# EAGLE design beerSch00 (EAGLE 9.3.0)
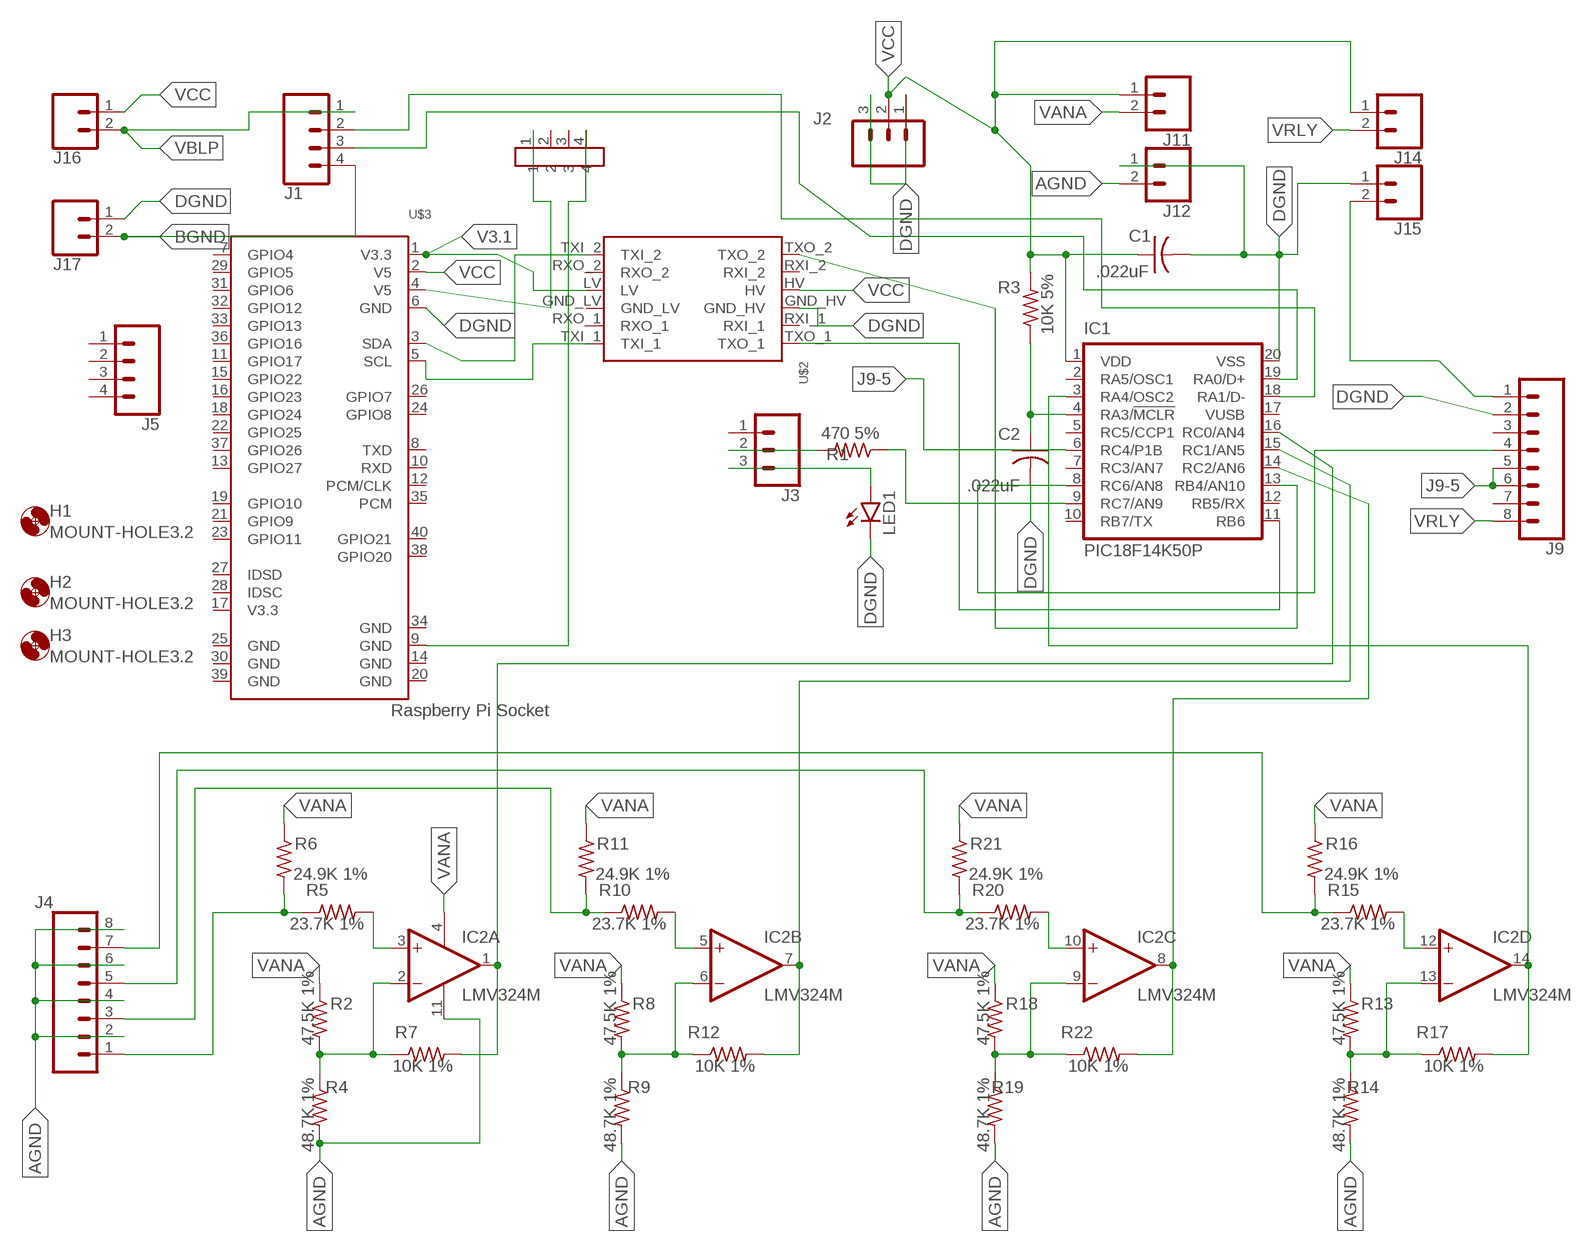
[diagram p0: schematic, sheet 1]

## Parts
C1  .022uF  C-USC0805  [C0805]
C2  .022uF  C-USC0805  [C0805]
H1  MOUNT-HOLE3.2  [3,2]
H2  MOUNT-HOLE3.2  [3,2]
H3  MOUNT-HOLE3.2  [3,2]
IC1  PIC18F14K50P  [DIL20]
IC2  LMV324M  [SO14]
J1  CONN_04  [1X04]
J2  CONN_03  [1X03]
J3  CONN_03  [1X03]
J4  CONN_08"  [1X08]
J5  CONN_04  [1X04]
J9  CONN_08"  [1X08]
J11  CONN_02  [1X02]
J12  CONN_02  [1X02]
J14  CONN_02  [1X02]
J15  CONN_02  [1X02]
J16  CONN_02  [1X02]
J17  CONN_02  [1X02]
LED1  LEDSML0805  [SML0805]
R1  470 5%  R-US_R0603  [R0603]
R2  47.5K 1%  R-US_R0603  [R0603]
R3  10K 5%  R-US_R0603  [R0603]
R4  48.7K 1%  R-US_R0603  [R0603]
R5  23.7K 1%  R-US_R0603  [R0603]
R6  24.9K 1%  R-US_R0603  [R0603]
R7  10K 1%  R-US_R0603  [R0603]
R8  47.5K 1%  R-US_R0603  [R0603]
R9  48.7K 1%  R-US_R0603  [R0603]
R10  23.7K 1%  R-US_R0603  [R0603]
R11  24.9K 1%  R-US_R0603  [R0603]
R12  10K 1%  R-US_R0603  [R0603]
R13  47.5K 1%  R-US_R0603  [R0603]
R14  48.7K 1%  R-US_R0603  [R0603]
R15  23.7K 1%  R-US_R0603  [R0603]
R16  24.9K 1%  R-US_R0603  [R0603]
R17  10K 1%  R-US_R0603  [R0603]
R18  47.5K 1%  R-US_R0603  [R0603]
R19  48.7K 1%  R-US_R0603  [R0603]
R20  23.7K 1%  R-US_R0603  [R0603]
R21  24.9K 1%  R-US_R0603  [R0603]
R22  10K 1%  R-US_R0603  [R0603]
U$1  CONN_4  [PINS_90]
U$2  LEVELCONV  [PLUG_THROUGHHOLE]
U$3  RASPBERRYPI_SOCKET_UNDER  [RASPBERRYPI_UNDERBD]

## Nets
AGND: IC2.11(P:V-) J4.2 J4.4 J4.6 J4.8 J12.2 R4.2 R9.2 R14.2 R19.2
BGND: J1.4 J17.2
DGND: C1.2 C2.2 IC1.20(VSS) J2.1 J2.3 J9.2 J12.1 J15.1 J17.1 LED1.C U$2.GND_HV U$3.6(GND)
J9-5: IC1.6(RC4/P1B) J9.5 J9.6
N$1: U$2.TXI_2 U$3.3(SDA)
N$2: U$2.TXI_1 U$3.5(SCL)
N$3: IC1.13(RB4/AN10) U$2.TXO_2
N$4: IC1.11(RB6) U$2.TXO_1
N$5: C2.1 IC1.4(RA3/!MCLR!) R3.1
N$6: J3.2 R1.2
N$7: IC1.9(RC7/AN9) R1.1
N$8: J3.3 LED1.A
N$9: IC2.2(A:-IN) R2.2 R4.1 R7.1
N$10: J4.1 R5.1 R6.2
N$11: IC2.3(A:+IN) R5.2
N$12: IC1.16(RC0/AN4) IC2.1(A:OUT) R7.2
N$13: IC2.6(B:-IN) R8.2 R9.1 R12.1
N$14: J4.3 R10.1 R11.2
N$15: IC2.5(B:+IN) R10.2
N$16: J9.1 J15.2
N$17: U$1.4 U$3.9(GND)
N$18: IC2.13(D:-IN) R13.2 R14.1 R17.1
N$19: J4.7 R15.1 R16.2
N$20: IC2.12(D:+IN) R15.2
N$21: IC1.8(RC6/AN8) J9.4
N$22: IC2.9(C:-IN) R18.2 R19.1 R22.1
N$23: J4.5 R20.1 R21.2
N$24: IC2.10(C:+IN) R20.2
N$25: U$1.1 U$3.4(V5)
N$26: IC1.19(RA0/D+) J1.3
N$28: IC1.3(RA4/OSC2) IC2.14(D:OUT) R17.2
N$29: IC1.14(RC2/AN6) IC2.8(C:OUT) R22.2
N$30: IC1.15(RC1/AN5) IC2.7(B:OUT) R12.2
N$31: IC1.18(RA1/D-) J1.2
V3.1: U$2.LV U$3.1(V3.3)
VANA: IC2.4(P:V+) J11.2 R2.1 R6.1 R8.1 R11.1 R13.1 R16.1 R18.1 R21.1
VBLP: J1.1 J16.2
VCC: C1.1 IC1.1(VDD) J2.2 J11.1 J14.1 J16.1 R3.2 U$2.HV U$3.2(V5)
VRLY: J9.8 J14.2
Unconnected: IC1.2(RA5/OSC1) IC1.5(RC5/CCP1) IC1.7(RC3/AN7) IC1.10(RB7/TX) IC1.12(RB5/RX) IC1.17(VUSB) J3.1 J5.1 J5.2 J5.3 J5.4 J9.3 J9.7 U$1.2 U$1.3 U$2.GND_LV U$2.RXI_1 U$2.RXI_2 U$2.RXO_1 U$2.RXO_2 U$3.7(GPIO4) U$3.8(TXD) U$3.10(RXD) U$3.11(GPIO17) U$3.12(PCM/CLK) U$3.13(GPIO27) U$3.14(GND) U$3.15(GPIO22) U$3.16(GPIO23) U$3.17(V3.3) U$3.18(GPIO24) U$3.19(GPIO10) U$3.20(GND) U$3.21(GPIO9) U$3.22(GPIO25) U$3.23(GPIO11) U$3.24(GPIO8) U$3.25(GND) U$3.26(GPIO7) U$3.27(IDSD) U$3.28(IDSC) U$3.29(GPIO5) U$3.30(GND) U$3.31(GPIO6) U$3.32(GPIO12) U$3.33(GPIO13) U$3.34(GND) U$3.35(PCM) U$3.36(GPIO16) U$3.37(GPIO26) U$3.38(GPIO20) U$3.39(GND) U$3.40(GPIO21)

## Library data of the parts
C1 C2 = resistor:C-US: CAPACITOR, American symbol
H1-H3 = holes:MOUNT-HOLE: MOUNTING HOLE with drill center marker
IC1 = pic18f14k50:PIC18F14K50
IC2 = linear:LMV324?*: Quad General Purpose, Low Voltage, Rail-to-Rail Output Operational Amplifiers Source: http://www.national.com/mpf/LM/LMV321.html http://www.national.com/dt/lmv_qual.pdf
J1 J5 = SparkFun-Connectors:CONN_04: Multi connection point. Often used as Generic Header-pin footprint for 0.1 inch spaced/style header connections On any of the 0.1 inch spaced packages, you can populate with these: Break Away Headers - Straight <https://www.sparkfun.com/products/116> (PRT-00116) Break Away Male Headers - Right Angle <https://www.sparkfun.com/products/553> (PRT-00553) Female Headers <https://www.sparkfun.com/products/115> (PRT-00115) Break Away Headers - Machine Pin <https://www.sparkfun.com/products/117> (PRT-00117) Break Away Female Headers - Swiss Machine Pin <https://www.sparkfun.com/products/743> (PRT-00743) For SCREWTERMINALS and SPRING TERMINALS visit here: Screw Terimnals on SparkFun.com <https://www.sparkfun.com/search/results?term=Screw+Terminals> (5mm/3.5mm/2.54mm spacing) This device is also useful as a general connection point to wire up your design to another part of your project. Our various solder wires solder well into these plated through hole pads. Hook-Up Wire - Assortment (Stranded, 22 AWG) <https://www.sparkfun.com/products/11375> (PRT-11375) Hook-Up Wire - Assortment (Solid Core, 22 AWG) <https://www.sparkfun.com/products/11367> (PRT-11367) View the entire wire category on our website here <https://www.sparkfun.com/categories/141> Special notes: Molex polarized connector foot print use with SKU : PRT-08231 with associated crimp pins and housings. 1MM SMD Version SKU: PRT-10208; PROD_ID: CONN-09696
J2 J3 = SparkFun-Connectors:CONN_03: Multi connection point. Often used as Generic Header-pin footprint for 0.1 inch spaced/style header connections On any of the 0.1 inch spaced packages, you can populate with these: Break Away Headers - Straight <https://www.sparkfun.com/products/116> (PRT-00116) Break Away Male Headers - Right Angle <https://www.sparkfun.com/products/553> (PRT-00553) Female Headers <https://www.sparkfun.com/products/115> (PRT-00115) Break Away Headers - Machine Pin <https://www.sparkfun.com/products/117> (PRT-00117) Break Away Female Headers - Swiss Machine Pin <https://www.sparkfun.com/products/743> (PRT-00743) Stackable Header - 3 Pin (Female, 0.1") <https://www.sparkfun.com/products/13875> (PRT-13875) For SCREWTERMINALS and SPRING TERMINALS visit here: Screw Terimnals on SparkFun.com <https://www.sparkfun.com/search/results?term=Screw+Terminals> (5mm/3.5mm/2.54mm spacing) This device is also useful as a general connection point to wire up your design to another part of your project. Our various solder wires solder well into these plated through hole pads. Hook-Up Wire - Assortment (Stranded, 22 AWG) <https://www.sparkfun.com/products/11375> (PRT-11375) Hook-Up Wire - Assortment (Solid Core, 22 AWG) <https://www.sparkfun.com/products/11367> (PRT-11367) View the entire wire category on our website here <https://www.sparkfun.com/categories/141> Special notes: Molex polarized connector foot print use with SKU : PRT-08232 with associated crimp pins and housings.
J4 J9 = SparkFun-Connectors:CONN_08: Multi connection point. Often used as Generic Header-pin footprint for 0.1 inch spaced/style header connections On any of the 0.1 inch spaced packages, you can populate with these: Break Away Headers - Straight <https://www.sparkfun.com/products/116> (PRT-00116) Break Away Male Headers - Right Angle <https://www.sparkfun.com/products/553> (PRT-00553) Female Headers <https://www.sparkfun.com/products/115> (PRT-00115) Break Away Headers - Machine Pin <https://www.sparkfun.com/products/117> (PRT-00117) Break Away Female Headers - Swiss Machine Pin <https://www.sparkfun.com/products/743> (PRT-00743) Arduino Stackable Header - 8 Pin <https://www.sparkfun.com/products/9279> (PRT-09279) For SCREWTERMINALS and SPRING TERMINALS visit here: Screw Terimnals on SparkFun.com <https://www.sparkfun.com/search/results?term=Screw+Terminals> (5mm/3.5mm/2.54mm spacing) This device is also useful as a general connection point to wire up your design to another part of your project. Our various solder wires solder well into these plated through hole pads. Hook-Up Wire - Assortment (Stranded, 22 AWG) <https://www.sparkfun.com/products/11375> (PRT-11375) Hook-Up Wire - Assortment (Solid Core, 22 AWG) <https://www.sparkfun.com/products/11367> (PRT-11367) View the entire wire category on our website here <https://www.sparkfun.com/categories/141> Special notes: Molex polarized connector foot print use with SKU : PRT-08231 with associated crimp pins and housings. 1MM SMD Version SKU: PRT-10208 NOTES ON THE VARIANTS LOCK and LOCK_LONGPADS... This footprint was designed to help hold the alignment of a through-hole component (i.e. 6-pin header) while soldering it into place. You may notice that each hole has been shifted either up or down by 0.005 of an inch from it's more standard position (which is a perfectly straight line). This slight alteration caused the pins (the squares in the middle) to touch the edges of the holes. Because they are alternating, it causes a "brace" to hold the component in place. 0.005 has proven to be the perfect amount of "off-center" position when using our standard breakaway headers. Although looks a little odd when you look at the bare footprint, once you have a header in there, the alteration is very hard to notice. Also,if you push a header all the way into place, it is covered up entirely on the bottom side.; PROD_ID: CONN-08438
J11 J12 J14-J17 = SparkFun-Connectors:CONN_02: Multi connection point. Often used as Generic Header-pin footprint for 0.1 inch spaced/style header connections On any of the 0.1 inch spaced packages, you can populate with these: Break Away Headers - Straight <https://www.sparkfun.com/products/116> (PRT-00116) Break Away Male Headers - Right Angle <https://www.sparkfun.com/products/553> (PRT-00553) Female Headers <https://www.sparkfun.com/products/115> (PRT-00115) Break Away Headers - Machine Pin <https://www.sparkfun.com/products/117> (PRT-00117) Break Away Female Headers - Swiss Machine Pin <https://www.sparkfun.com/products/743> (PRT-00743) For SCREWTERMINALS and SPRING TERMINALS visit here: Screw Terimnals on SparkFun.com <https://www.sparkfun.com/search/results?term=Screw+Terminals> (5mm/3.5mm/2.54mm spacing) This device is also useful as a general connection point to wire up your design to another part of your project. Our various solder wires solder well into these plated through hole pads. Hook-Up Wire - Assortment (Stranded, 22 AWG) <https://www.sparkfun.com/products/11375> (PRT-11375) Hook-Up Wire - Assortment (Solid Core, 22 AWG) <https://www.sparkfun.com/products/11367> (PRT-11367) View the entire wire category on our website here <https://www.sparkfun.com/categories/141> Special notes: Molex polarized connector foot print use with: PRT-08233 with associated crimp pins and housings. 2.54_SCREWTERM for use with PRT-10571. 3.5mm Screw Terminal footprints for PRT-08084 5mm Screw Terminal footprints for use with PRT-08432
LED1 = led:LED: LED OSRAM: - CHIPLED LG R971, LG N971, LY N971, LG Q971, LY Q971, LO R971, LY R971 LH N974, LH R974 LS Q976, LO Q976, LY Q976 LO Q996 - Hyper CHIPLED LW Q18S LB Q993, LB Q99A, LB R99A - SideLED LS A670, LO A670, LY A670, LG A670, LP A670 LB A673, LV A673, LT A673, LW A673 LH A674 LY A675 LS A676, LA A676, LO A676, LY A676, LW A676 LS A679, LY A679, LG A679 - Hyper Micro SIDELED® LS Y876, LA Y876, LO Y876, LY Y876 LT Y87S - SmartLED LW L88C, LW L88S LB L89C, LB L89S, LG L890 LS L89K, LO L89K, LY L89K LS L896, LA L896, LO L896, LY L896 - TOPLED LS T670, LO T670, LY T670, LG T670, LP T670 LSG T670, LSP T670, LSY T670, LOP T670, LYG T670 LG T671, LOG T671, LSG T671 LB T673, LV T673, LT T673, LW T673 LH T674 LS T676, LA T676, LO T676, LY T676, LB T676, LH T676, LSB T676, LW T676 LB T67C, LV T67C, LT T67C, LS T67K, LO T67K, LY T67K, LW E67C LS E67B, LA E67B, LO E67B, LY E67B, LB E67C, LV E67C, LT E67C LW T67C LS T679, LY T679, LG T679 LS T770, LO T770, LY T770, LG T770, LP T770 LB T773, LV T773, LT T773, LW T773 LH T774 LS E675, LA E675, LY E675, LS T675 LS T776, LA T776, LO T776, LY T776, LB T776 LHGB T686 LT T68C, LB T68C - Hyper Mini TOPLED® LB M676 - Mini TOPLED Santana® LG M470 LS M47K, LO M47K, LY M47K Source: http://www.osram.convergy.de LUXEON: - LUMILED® LXK2-PW12-R00, LXK2-PW12-S00, LXK2-PW14-U00, LXK2-PW14-V00 LXK2-PM12-R00, LXK2-PM12-S00, LXK2-PM14-U00 LXK2-PE12-Q00, LXK2-PE12-R00, LXK2-PE12-S00, LXK2-PE14-T00, LXK2-PE14-U00 LXK2-PB12-K00, LXK2-PB12-L00, LXK2-PB12-M00, LXK2-PB14-N00, LXK2-PB14-P00, LXK2-PB14-Q00 LXK2-PR12-L00, LXK2-PR12-M00, LXK2-PR14-Q00, LXK2-PR14-R00 LXK2-PD12-Q00, LXK2-PD12-R00, LXK2-PD12-S00 LXK2-PH12-R00, LXK2-PH12-S00 LXK2-PL12-P00, LXK2-PL12-Q00, LXK2-PL12-R00 Source: www.luxeon.com KINGBRIGHT: KA-3528ASYC Source: www.kingbright.com
R1-R22 = resistor:R-US_: RESISTOR, American symbol
U$1 = Connectors:CONN_4
U$2 = LevelConv:LEVELCONV
U$3 = RaspberryPi:RASPBERRYPI_SOCKET_UNDER

## Board
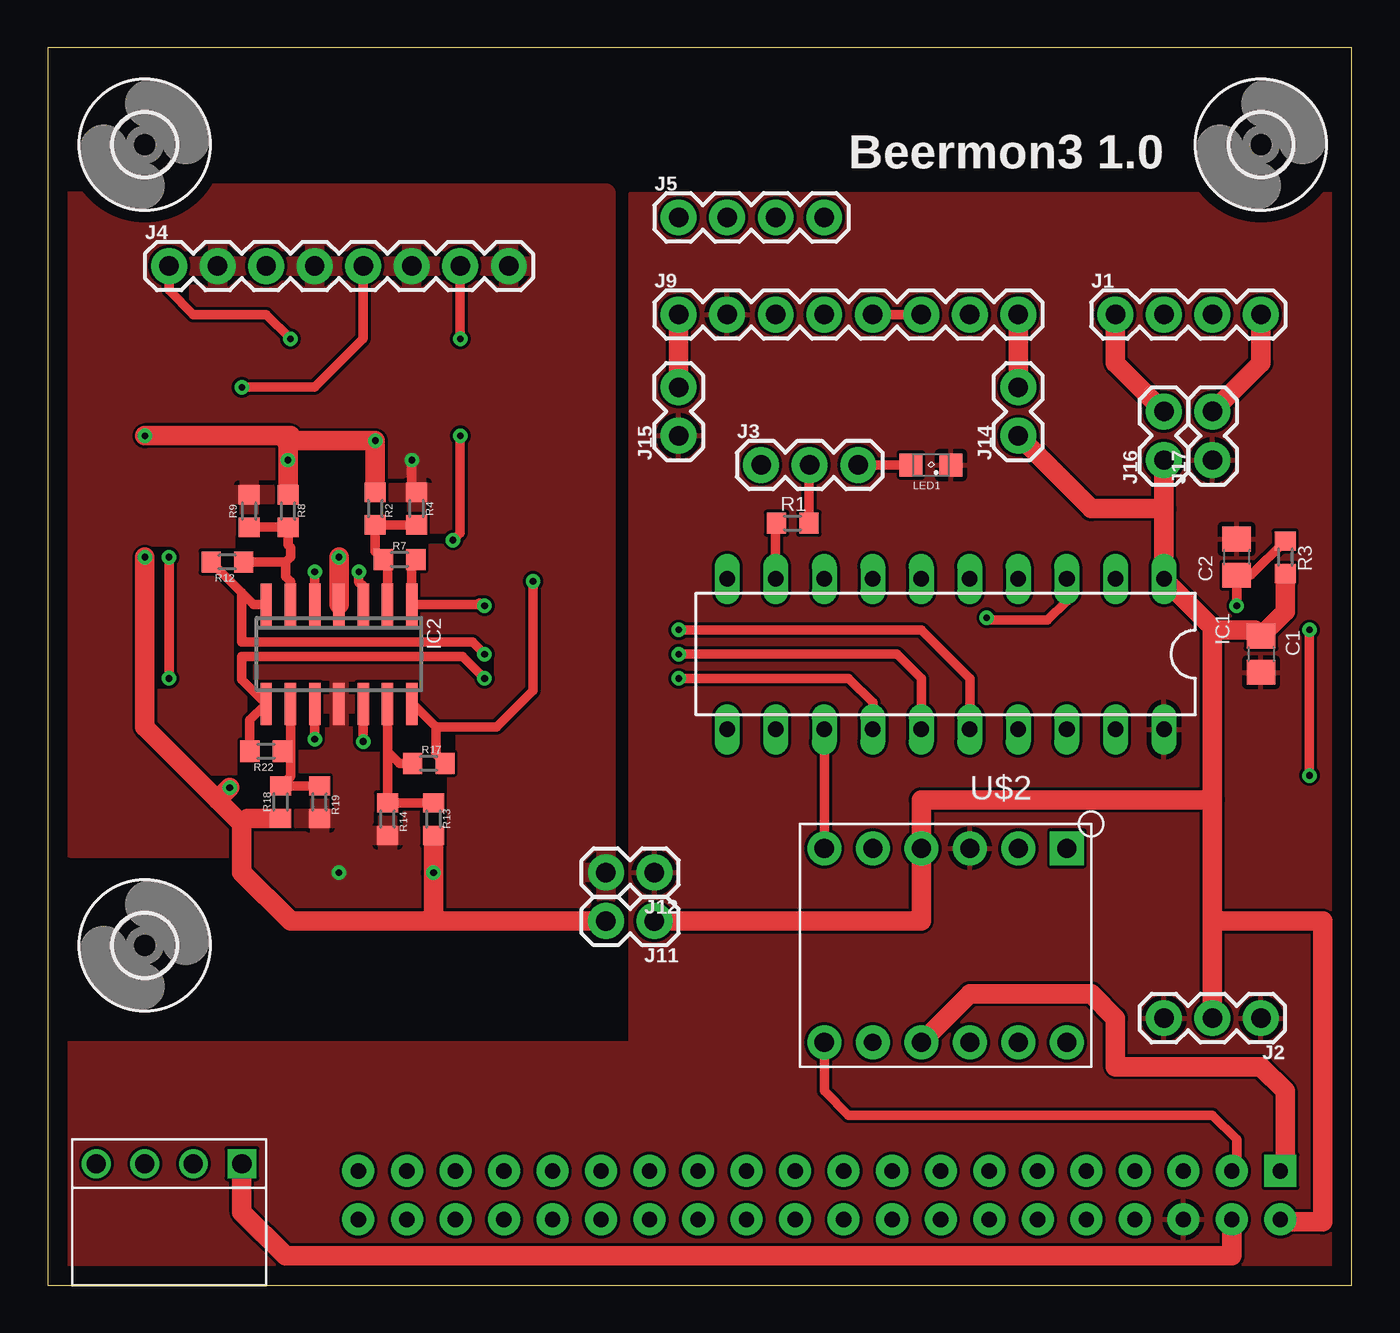
[diagram p1: board, top side]
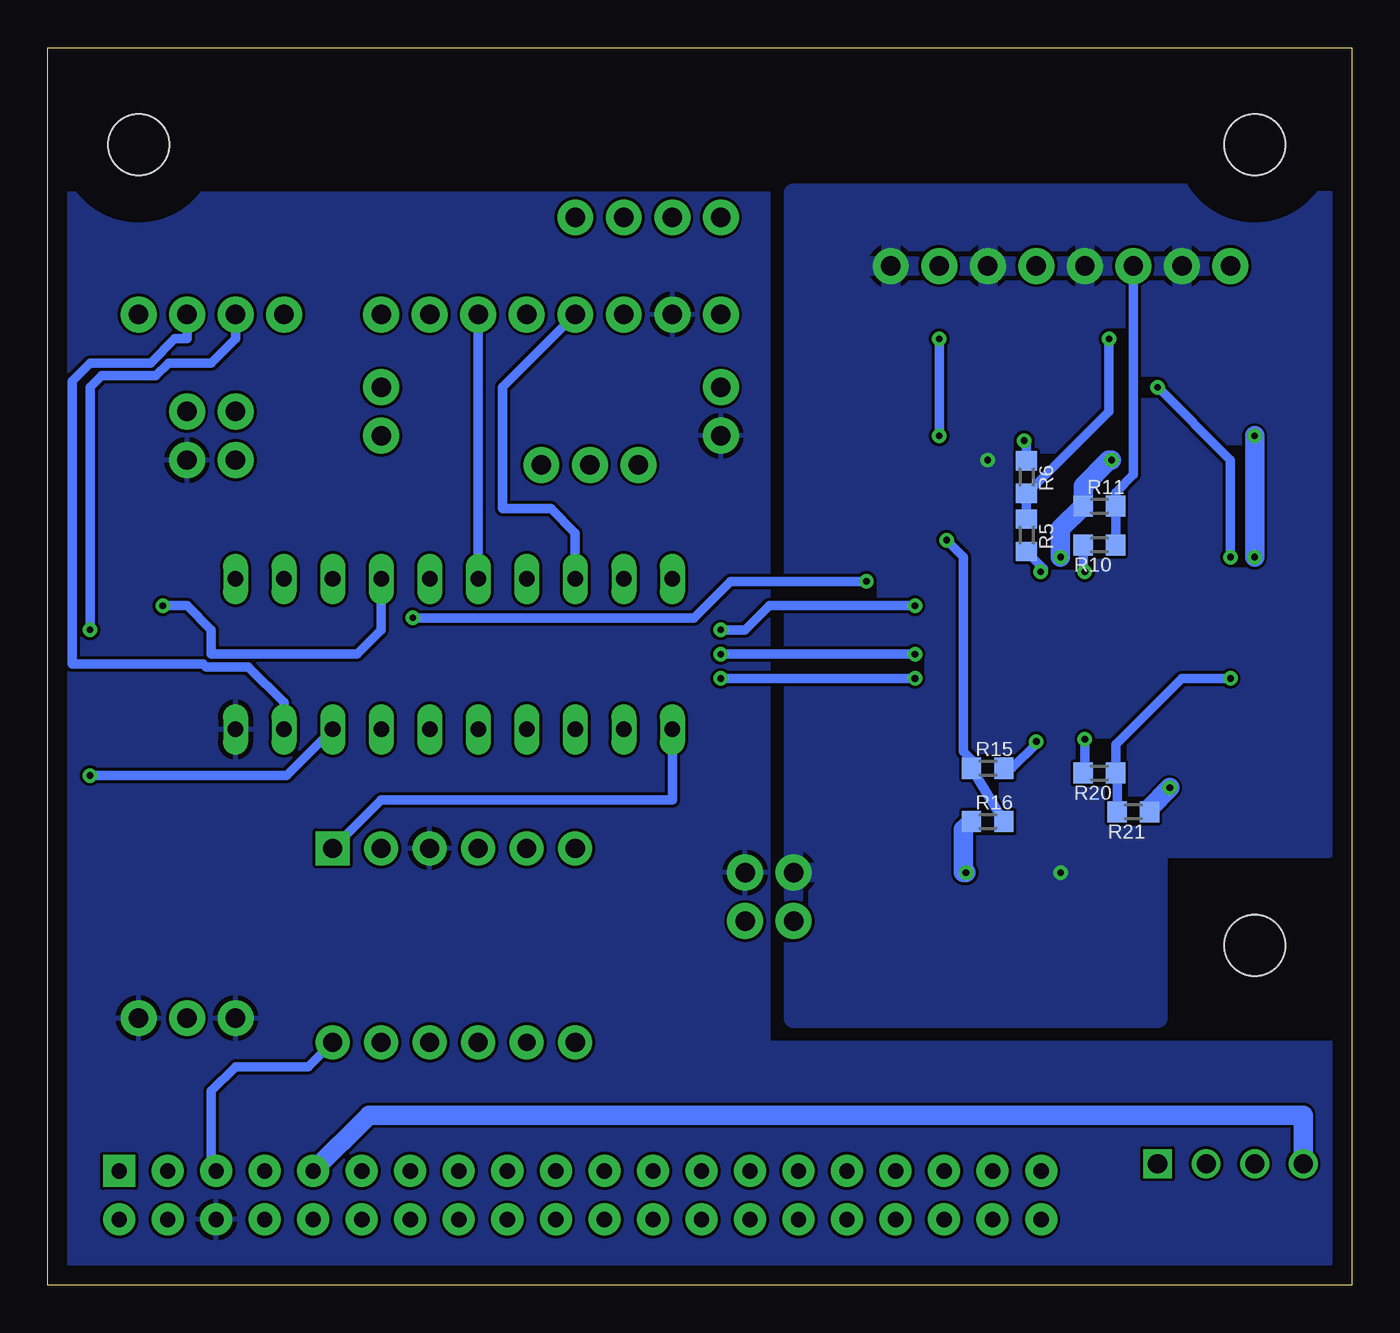
[diagram p2: board, bottom side, seen from below]

Size 68.25 x 64.76 mm. Coordinates in mm from the lower left corner, seen from the top.
Outline: 0,0 68.25,0 68.25,64.76 0,64.76 0,0
Copper layers (1*16): Top 0.035mm / dielectric 1.5mm / Bottom 0.035mm
Design rules "default *": minimum track width 6mil, minimum drill 0.35mm, track to track 6mil, track to pad 6mil, pad to pad 6mil, via to via 6mil, smd to smd 6mil, copper to edge 40mil, drill to drill 6mil, minimum pad ring 10mil, minimum via ring 8mil, stop-mask expansion 4mil, vias tented up to drill 0mil, thermal gap 10mil

### Footprints (pad centres in the part's own frame; a part is rotated, then mirrored left to right if it is on the bottom)
C0805 = smd 1.3 x 1.5: 1 -0.95,0; 2 0.95,0
3,2 = hole 3.2: 0,0
DIL20 = drill 0.813 long: 1 -11.43,-3.937; 2 -8.89,-3.937; 3 -6.35,-3.937; 4 -3.81,-3.937; 5 -1.27,-3.937; 6 1.27,-3.937; 7 3.81,-3.937; 8 6.35,-3.937; 9 8.89,-3.937; 10 11.43,-3.937; 11 11.43,3.937; 12 8.89,3.937; 13 6.35,3.937; 14 3.81,3.937; 15 1.27,3.937; 16 -1.27,3.937; 17 -3.81,3.937; 18 -6.35,3.937; 19 -8.89,3.937; 20 -11.43,3.937
SO14 = smd 0.6 x 2.2: 1 -3.81,-2.6; 2 -2.54,-2.6; 3 -1.27,-2.6; 4 0,-2.6; 5 1.27,-2.6; 6 2.54,-2.6; 7 3.81,-2.6; 8 3.81,2.6; 9 2.54,2.6; 10 1.27,2.6; 11 0,2.6; 12 -1.27,2.6; 13 -2.54,2.6; 14 -3.81,2.6
1X04 = drill 1.016 pad 1.88: 1 0,0; 2 2.54,0; 3 5.08,0; 4 7.62,0
1X03 = drill 1.016 pad 1.88: 1 0,0; 2 2.54,0; 3 5.08,0
1X08 = drill 1.016 pad 1.88: 1 0,0; 2 2.54,0; 3 5.08,0; 4 7.62,0; 5 10.16,0; 6 12.7,0; 7 15.24,0; 8 17.78,0
1X02 = drill 1.016 pad 1.88: 1 0,0; 2 2.54,0
SML0805 = smd 1.2 x 1.2: A 1.05,0; C -1.05,0
R0603 = smd 1 x 1.1: 1 -0.85,0; 2 0.85,0
PINS_90 = drill 1 square: 1 -5.08,-2.54 | drill 1: 2 -2.54,-2.54; 3 0,-2.54; 4 2.54,-2.54
PLUG_THROUGHHOLE = drill 1 pad 1.778: GND_HV 2.54,5.08; GND_LV 2.54,-5.08; HV 0,5.08; LV 0,-5.08; RXI_1 5.08,5.08; RXI_2 -2.54,5.08; RXO_1 5.08,-5.08; TXI_1 7.62,-5.08; TXI_2 -5.08,-5.08; TXO_2 -5.08,5.08 | drill 0.9 pad 1.778: RXO_2 -2.54,-5.08 | drill 1 pad 1.778 square: TXO_1 7.62,5.08
RASPBERRYPI_UNDERBD = drill 0.8 pad 1.676 square: 1 -25.4,0 | drill 0.8 pad 1.676: 2 -25.4,2.54; 3 -22.86,0; 4 -22.86,2.54; 5 -20.32,0; 6 -20.32,2.54; 7 -17.78,0; 8 -17.78,2.54; 9 -15.24,0; 10 -15.24,2.54; 11 -12.7,0; 12 -12.7,2.54; 13 -10.16,0; 14 -10.16,2.54; 15 -7.62,0; 16 -7.62,2.54; 17 -5.08,0; 18 -5.08,2.54; 19 -2.54,0; 20 -2.54,2.54; 21 0,0; 22 0,2.54; 23 2.54,0; 24 2.54,2.54; 25 5.08,0; 26 5.08,2.54; 27 7.62,0; 28 7.62,2.54; 29 10.16,0; 30 10.16,2.54; 31 12.7,0; 32 12.7,2.54; 33 15.24,0; 34 15.24,2.54; 35 17.78,0; 36 17.78,2.54; 37 20.32,0; 38 20.32,2.54; 39 22.86,0; 40 22.86,2.54

### Placement (x,y rotation side)
C1  63.5,33.02 270 top
C2  62.23,38.1 90 top
H1  63.5,59.69 0 top
H2  5.08,59.69 0 top
H3  5.08,17.78 0 top
IC1  46.99,33.02 180 top
IC2  15.24,33.02 180 top
J1  55.88,50.8 0 top
J2  63.5,13.97 180 top
J3  37.34,42.93 0 top
J4  6.35,53.34 0 top
J5  33.02,55.88 0 top
J9  33.02,50.8 0 top
J11  31.75,19.05 180 top
J12  31.75,21.59 180 top
J14  50.8,44.45 90 top
J15  33.02,44.45 90 top
J16  58.42,43.18 90 top
J17  60.96,43.18 90 top
LED1  46.23,42.93 180 top
R1  38.99,39.88 0 top
R2  17.14,40.64 270 top
R3  64.77,38.1 270 top
R4  19.3,40.64 90 top
R5  17.02,39.24 270 bottom
R6  17.02,42.29 270 bottom
R7  18.41,37.97 0 top
R8  12.57,40.51 270 top
R9  10.54,40.51 90 top
R10  13.21,38.73 180 bottom
R11  13.21,40.77 0 bottom
R12  9.4,37.85 180 top
R13  20.19,24.38 90 top
R14  17.78,24.38 270 top
R15  19.05,27.05 0 bottom
R16  19.05,24.26 0 bottom
R17  19.94,27.3 0 top
R18  12.19,25.27 90 top
R19  14.22,25.27 270 top
R20  13.21,26.8 180 bottom
R21  11.43,24.77 180 bottom
R22  11.43,27.94 180 top
U$1  5.08,3.81 180 top
U$2  45.72,17.78 0 top
U$3  39.12,5.97 180 top

### Tracks (layer width: path | path; a pad name or v marks a point on that pad's centre or on a via)
AGND  (via drill 0.35)
  Top 0.508: R4.2 19.05,41.74 v19.05,43.18
  other vias: 15.24,21.59
  pour Top: 10.16,13.97 29.21,13.97 29.21,57.15 1.27,57.15 1.27,22.86 10.16,22.86
  pour Bottom: 10.16,13.97 29.21,13.97 29.21,57.15 1.27,57.15 1.27,22.86 10.16,22.86
BGND
  Top 1.016: J17.2 63.5,48.26 J1.4
DGND
  pour Top: 0,0 0,12.7 30.48,12.7 30.48,57.15 68.58,57.15 68.58,0
  pour Bottom: 0,0 0,12.7 30.48,12.7 30.48,57.15 68.58,57.15 68.58,0
J9-5
  Top 0.508: J9.6 J9.5
  Bottom 0.508: J9.6 IC1.6
N$1
  Top 0.508: U$2.TXI_2 40.64,10.16 41.91,8.89 60.96,8.89 62.23,7.62 62.23,6.22 U$3.3
N$2
  Bottom 0.508: U$2.TXI_1 54.61,11.43 58.42,11.43 59.69,10.16 59.69,6.22 U$3.5
N$3
  Top 0.508: U$2.TXO_2 IC1.13
N$4
  Bottom 0.508: IC1.11 35.56,25.4 50.8,25.4 U$2.TXO_1
N$5  (via drill 0.35)
  Top 0.508: R3.1 62.97,37.15 C2.1 v62.23,35.56
  Bottom 0.508: v62.23,35.56 60.96,35.56 59.69,34.29 59.69,33.02 52.07,33.02 50.8,34.29 IC1.4
N$6
  Top 0.508: R1.2 39.84,42.89 J3.2
N$7
  Top 0.508: IC1.9 38.1,39.84 R1.1
N$8
  Top 0.508: J3.3 LED1.A
N$9
  Top 0.508: R4.1 R2.2 17.14,38.39 R7.1 17.78,37.76 IC2.2
N$10  (via drill 0.35)
  Top 0.508: v12.7,49.53 11.43,50.8 7.62,50.8 6.35,52.07 J4.1
  Bottom 0.508: R5.1 R6.2 16.98,41.44 12.7,45.72 v12.7,49.53
N$11  (via drill 0.35)
  Top 0.508: v16.28,37.34 16.28,36.81 16.51,36.58 IC2.3
  Bottom 0.508: R5.2 16.13,37.5 16.13,37.34 v16.28,37.34
N$12  (via drill 0.35)
  Top 0.508: IC1.16 48.26,31.75 45.72,34.29 v33.02,34.29 | R7.2 19.05,37.76 IC2.1 22.54,35.62 22.61,35.69 22.73,35.56 v22.86,35.56
  Bottom 0.508: v22.86,35.56 30.48,35.56 31.75,34.29 v33.02,34.29
N$13
  Top 0.508: R9.1 R8.2 12.57,38.73 12.7,38.61 12.7,38.1 12.45,37.85 | 12.45,37.85 R12.1 | 12.45,37.85 12.45,37.08 12.7,36.83 IC2.6
N$14
  Bottom 0.508: R10.1 R11.2 12.36,41.49 11.43,42.42 J4.3
N$15  (via drill 0.35)
  Top 0.508: v13.97,37.34 IC2.5
  Bottom 0.508: R10.2 14.06,37.43 v13.97,37.34
N$16
  Top 1.016: J15.2 J9.1
N$17
  Bottom 1.016: U$1.4 2.54,8.89 51.44,8.89 U$3.9
N$18
  Top 0.508: R13.2 R14.1 17.78,27.94 | 17.78,27.94 IC2.13 | 17.78,27.94 18.41,27.3 R17.1
N$19  (via drill 0.35)
  Top 0.508: v21.21,38.99 21.59,39.37 v21.59,44.45 | v21.59,49.53 J4.7
  Bottom 0.508: R16.2 R15.1 19.9,27.52 20.32,27.94 20.32,38.1 v21.21,38.99 | v21.59,44.45 v21.59,49.53
N$20  (via drill 0.35)
  Top 0.508: v16.51,28.45 IC2.12
  Bottom 0.508: R15.2 17.78,27.05 16.51,28.32 v16.51,28.45
N$21
  Bottom 0.508: J9.4 44.45,46.99 44.45,40.64 41.91,40.64 40.64,39.37 IC1.8
N$22
  Top 0.508: R19.1 R18.2 12.7,26.63 12.7,27.94 | 12.7,27.94 IC2.9 | R22.1 12.7,27.94
N$23  (via drill 0.35)
  Top 0.508: v10.16,46.99 13.97,46.99 16.51,49.53 J4.5 | v6.35,31.75 v6.35,38.1
  Bottom 0.508: R21.2 12.28,26.72 R20.1 12.36,28.28 8.89,31.75 v6.35,31.75 | v10.16,46.99 6.35,43.18 v6.35,38.1
N$24  (via drill 0.35)
  Top 0.508: v13.97,28.57 IC2.10
  Bottom 0.508: R20.2 13.97,26.89 v13.97,28.57
N$25
  Top 1.016: U$3.4 61.98,1.52 12.45,1.52 10.16,3.81 U$1.1
N$26
  Bottom 0.508: J1.3 60.96,49.53 61.59,49.53 62.87,48.26 66.04,48.26 66.98,47.32 66.98,32.51 60.12,32.51 59.96,32.36 57.76,32.36 55.88,30.48 IC1.19
N$28  (via drill 0.35)
  Top 0.508: R17.2 20.32,27.77 20.32,29.21 | 20.32,29.21 19.11,30.42 IC2.14 | 20.32,29.21 23.5,29.21 25.4,31.11 v25.4,36.83 | v49.15,34.92 49.28,34.8 52.32,34.8 53.34,35.81 IC1.3
  Bottom 0.508: v25.4,36.83 32.51,36.83 34.42,34.92 v49.15,34.92
N$29  (via drill 0.35)
  Top 0.508: R22.2 10.58,29.57 IC2.8 10.16,31.69 10.16,32.89 21.72,32.89 v22.86,31.75 | v33.02,31.75 41.91,31.75 43.18,30.48 IC1.14
  Bottom 0.508: v22.86,31.75 v33.02,31.75
N$30  (via drill 0.35)
  Top 0.508: IC2.7 10.77,35.62 10.16,36.23 | 10.16,36.23 R12.2 | v33.02,33.02 44.45,33.02 45.72,31.75 IC1.15 | 10.16,36.23 10.16,33.66 22.23,33.66 v22.86,33.02
  Bottom 0.508: v22.86,33.02 v33.02,33.02
N$31  (via drill 0.35)
  Top 0.508: v66.04,34.29 v66.04,26.67
  Bottom 0.508: J1.2 58.42,49.53 59.69,48.26 61.93,48.26 62.59,47.6 65.43,47.6 66.04,46.99 v66.04,34.29 | IC1.18 55.75,26.67 v66.04,26.67
V3.1
  Top 1.016: U$2.LV 48.26,15.24 54.61,15.24 55.88,13.97 55.88,11.43 63.5,11.43 64.77,10.16 64.77,6.22 U$3.1
VANA  (via drill 0.35)
  Top 1.016: J11.2 20.32,19.05 | 20.32,19.05 12.7,19.05 10.16,21.59 10.16,24.13 | 8.89,25.4 5.08,29.21 v5.08,38.1 | 8.89,25.4 10.16,24.13 | v5.08,44.45 12.7,44.45 12.45,44.2 | R8.1 v12.57,43.18 12.57,44.07 12.45,44.2 | IC2.4 v15.24,38.1 | 12.45,44.2 v17.14,44.2 R2.1 | 10.16,24.13 10.45,24.42 R18.1 | 8.89,25.4 v9.53,26.04 | R13.1 v20.19,21.59 20.19,19.18 20.32,19.05
  Bottom 0.508: R6.1 17.02,44.07 v17.14,44.2
  Bottom 1.016: v15.24,38.1 15.24,39.59 R11.1 14.06,41.82 12.7,43.18 v12.57,43.18 | v5.08,38.1 v5.08,44.45 | v9.53,26.04 10.58,24.98 R21.1 | R16.1 20.32,23.84 20.32,21.59 v20.19,21.59
VBLP
  Top 1.016: J16.2 55.88,48.26 J1.1
VCC
  Top 0.152: C1.1 63.18,34.29
  Top 1.016: J2.2 60.96,19.05 | 60.96,19.05 60.96,25.4 | 60.96,25.4 45.72,25.4 U$2.HV 45.72,19.05 J11.1 | 60.96,25.4 60.96,34.29 | 63.18,34.29 60.96,34.29 | 60.96,34.29 60.96,34.42 IC1.1 58.42,40.64 | 60.96,19.05 66.73,19.05 66.73,3.3 64.64,3.3 U$3.2 | C1.1 64.77,35.24 R3.2 | 58.42,40.64 54.61,40.64 J14.1 | 58.42,40.64 J16.1
VRLY
  Top 1.016: J14.2 J9.8

### Text on the board
tNames: Beermon3 1.0